# Altium schematic sheet FEEL_2021_actuator.SchDoc
size A4; SheetNumber: 5; SheetTotal: 5
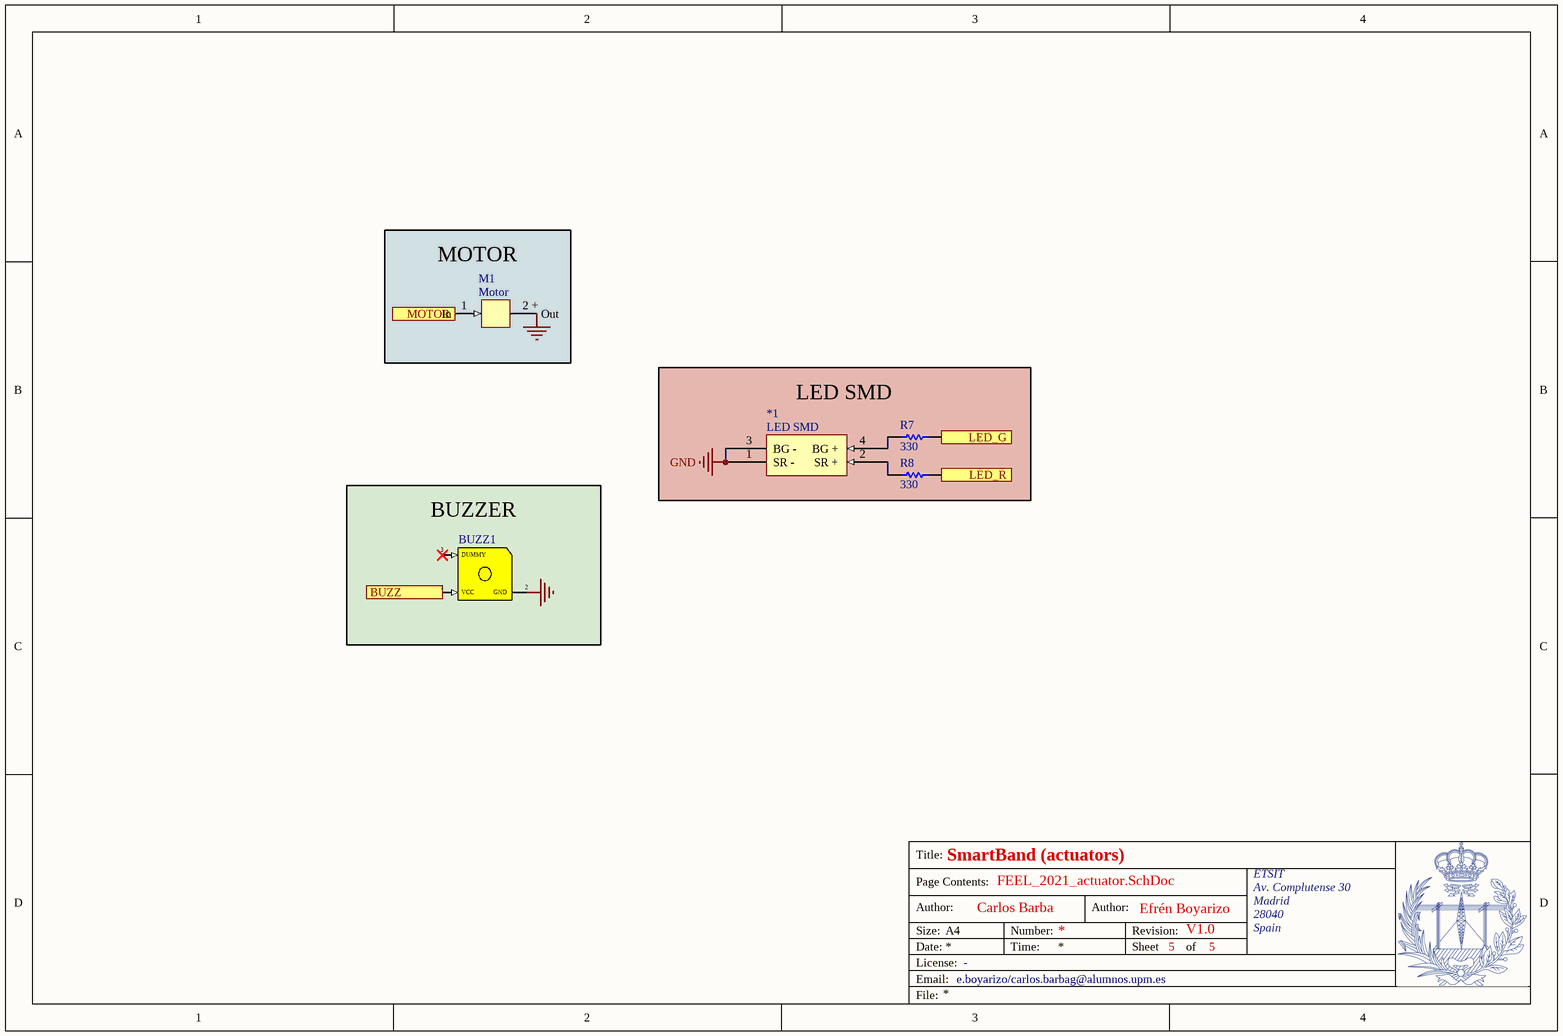
[diagram p0: FEEL_2021_actuator.SchDoc]

## Parts
*1  LED  [LED_SMD]  (value not drawn)
BUZZ1  Surface_Mount_Buzzer  [buzzer]  (value not drawn)
M1  MOTOR  [Motor]  (value not drawn)
R7  330  [RESC1609X50X30NL8T20]
R8  330  [RESC1609X50X30NL8T20]

## Ports
BUZZ (in), LED_G (in), LED_R (in), MOTOR (in)

## Nets
GND: *1.1(SR_-) *1.3(BG_-) BUZZ1.2(GND) M1.2_+(Out)
BUZZ: BUZZ1.1(VCC) ; port BUZZ
LED_G: R7.2 ; port LED_G
LED_R: R8.2 ; port LED_R
MOTOR: M1.1(In) ; port MOTOR
Net*1_2: *1.2(SR_+) R8.1
Net*1_4: *1.4(BG_+) R7.1

Not connected (* = marked no-connect by the designer): BUZZ1 3(DUMMY)*

## Notes on the sheet
- (near M1) MOTOR
- LED SMD
- (near BUZZ1) BUZZER
- Title:
- SmartBand (actuators)
- Author:
- Page Contents:
- Carlos Barba
- Efrén Boyarizo
- V1.0
- ETSIT
- Av. Complutense 30
- Madrid
- 28040
- Size:
- Date:
- File:
- License:
- Email:
- A4
- e.boyarizo/carlos.barbag@alumnos.upm.es
- -
- Number:
- Time:
- Revision:
- Sheet
- of
- 5
- Spain
- (in symbol LED) LED SMD
- (in symbol MOTOR) Motor

## Library data of the parts
R7 R8 = CMP-2000-03816-5: Chip Resistor, 0 Ohm, Jumper, 100 mW, -55 to 155 degC, 0603 (1608 Metric), RoHS, Tape and Reel; Manufacturer: Vishay Semiconductor; Voltage Rating: 75 V; Package Quantity: 5000; DatasheetVersion: 06/2012; Min Operating Temperature: -55 degC; ComponentLink1URL: http://www.vishay.com/; Mounting Technology: Surface Mount; Height: 0.45 mm; ComponentLink1Description: Manufacturer URL; REACH SVHC: Unknown; PackageReference: 0603; Packaging: Tape and Reel; Max Operating Temperature: 155 degC; Mount: Surface Mount; ComponentLink2Description: Datasheet; PackageDescription: 2-Pin Surface Mount Device, Body 1.575 x 0.85 mm; Length: 1.55 mm; ComponentLink2URL: http://www.vishay.com/docs/20035/dcrcwe3.pdf; Pins: 2; RoHSCompliant: true